# Altium schematic sheet Sheet2.SchDoc
size A3; DocumentNumber: 2; SheetNumber: 2; SheetTotal: 4
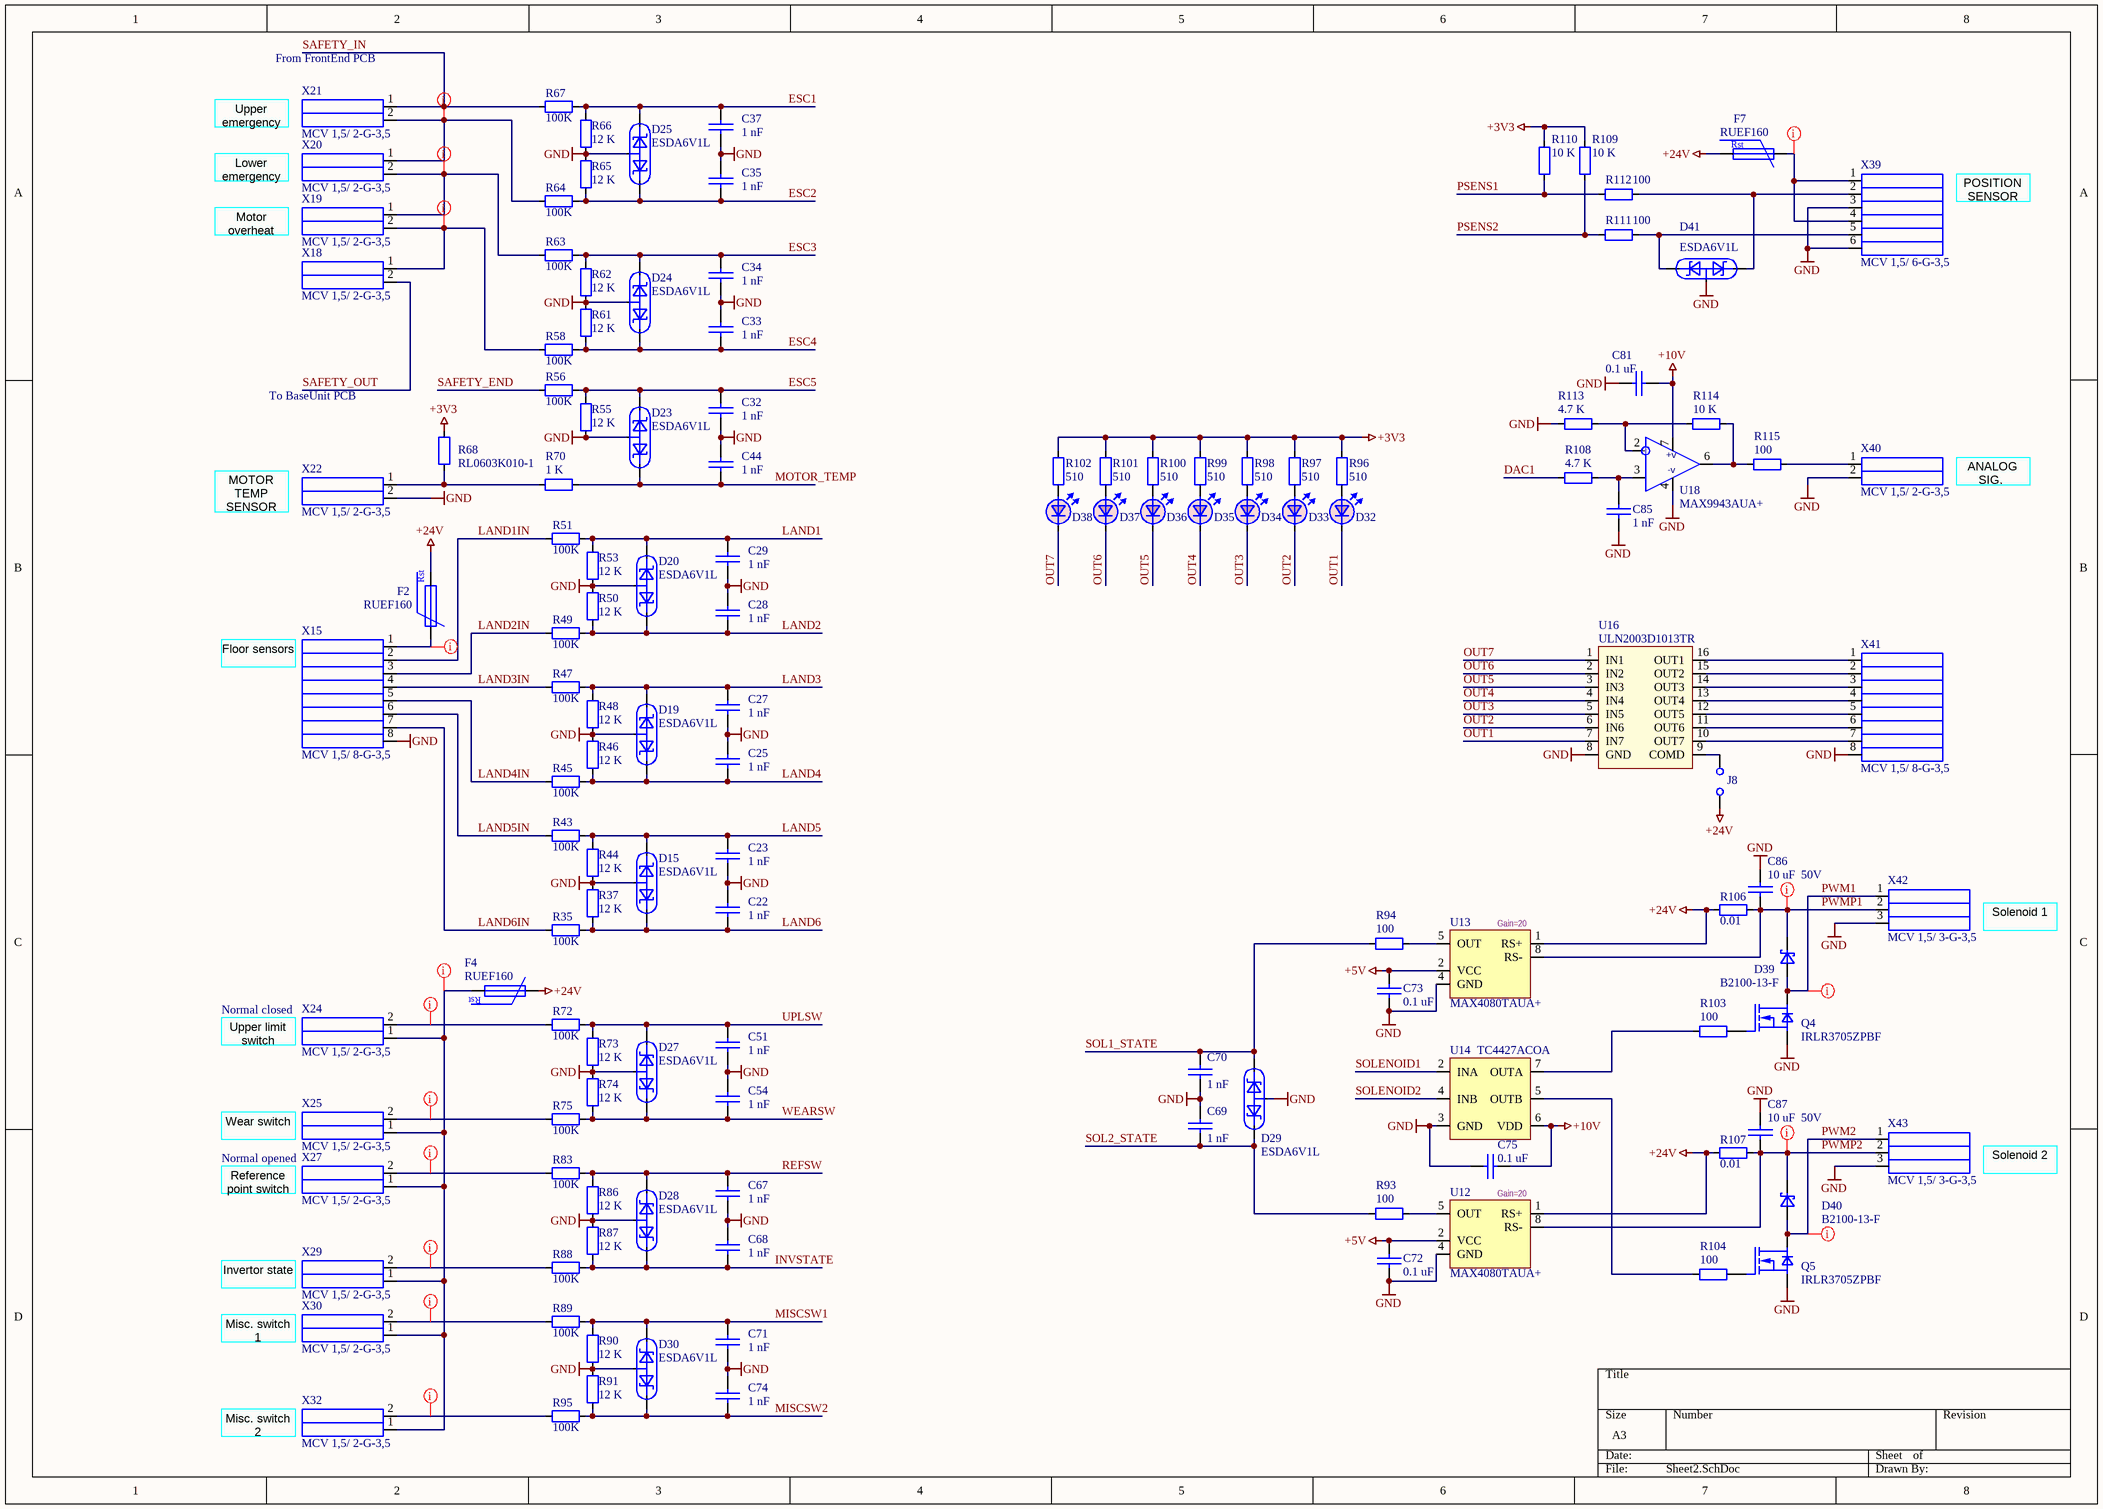
[diagram p0: Sheet2.SchDoc]

## Parts
C22  value 1 nF  [1608[0603]]  (hidden comment: CVNF1.0K0603)
C23  value 1 nF  [1608[0603]]  (hidden comment: CVNF1.0K0603)
C25  value 1 nF  [1608[0603]]  (hidden comment: CVNF1.0K0603)
C27  value 1 nF  [1608[0603]]  (hidden comment: CVNF1.0K0603)
C28  value 1 nF  [1608[0603]]  (hidden comment: CVNF1.0K0603)
C29  value 1 nF  [1608[0603]]  (hidden comment: CVNF1.0K0603)
C32  value 1 nF  [1608[0603]]  (hidden comment: CVNF1.0K0603)
C33  value 1 nF  [1608[0603]]  (hidden comment: CVNF1.0K0603)
C34  value 1 nF  [1608[0603]]  (hidden comment: CVNF1.0K0603)
C35  value 1 nF  [1608[0603]]  (hidden comment: CVNF1.0K0603)
C37  value 1 nF  [1608[0603]]  (hidden comment: CVNF1.0K0603)
C44  value 1 nF  [1608[0603]]  (hidden comment: CVNF1.0K0603)
C51  value 1 nF  [1608[0603]]  (hidden comment: CVNF1.0K0603)
C54  value 1 nF  [1608[0603]]  (hidden comment: CVNF1.0K0603)
C67  value 1 nF  [1608[0603]]  (hidden comment: CVNF1.0K0603)
C68  value 1 nF  [1608[0603]]  (hidden comment: CVNF1.0K0603)
C69  value 1 nF  [1608[0603]]  (hidden comment: CVNF1.0K0603)
C70  value 1 nF  [1608[0603]]  (hidden comment: CVNF1.0K0603)
C71  value 1 nF  [1608[0603]]  (hidden comment: CVNF1.0K0603)
C72  value 0.1 uF  [1608[0603]]  (hidden comment: CVNF100K0603-25)
C73  value 0.1 uF  [1608[0603]]  (hidden comment: CVNF100K0603-25)
C74  value 1 nF  [1608[0603]]  (hidden comment: CVNF1.0K0603)
C75  value 0.1 uF  [1608[0603]]  (hidden comment: CVNF100K0603-25)
C81  value 0.1 uF  [1608[0603]]  (hidden comment: CVNF100K0603-25)
C85  value 1 nF  [1608[0603]]  (hidden comment: CVNF1.0K0603)
C86  value 10 uF  Voltage: 50V  [3225[1210]]  (hidden comment: GRM32DF51H106ZA01L)
C87  value 10 uF  Voltage: 50V  [3225[1210]]  (hidden comment: GRM32DF51H106ZA01L)
D15  ESDA6V1L  [SOT23]
D19  ESDA6V1L  [SOT23]
D20  ESDA6V1L  [SOT23]
D23  ESDA6V1L  [SOT23]
D24  ESDA6V1L  [SOT23]
D25  ESDA6V1L  [SOT23]
D27  ESDA6V1L  [SOT23]
D28  ESDA6V1L  [SOT23]
D29  ESDA6V1L  [SOT23]
D30  ESDA6V1L  [SOT23]
D32  SML-211UTT86  [0805 LED]  (value not drawn)
D33  SML-211UTT86  [0805 LED]  (value not drawn)
D34  SML-211UTT86  [0805 LED]  (value not drawn)
D35  SML-211UTT86  [0805 LED]  (value not drawn)
D36  SML-211UTT86  [0805 LED]  (value not drawn)
D37  SML-211UTT86  [0805 LED]  (value not drawn)
D38  SML-211UTT86  [0805 LED]  (value not drawn)
D39  B2100-13-F  [SMB ST]
D40  B2100-13-F  [SMB ST]
D41  ESDA6V1L  [SOT23]
F2  RUEF160  [RUE160]
F4  RUEF160  [RUE160]
F7  RUEF160  [RUE160]
J8  PH1-02-TA-HT  [HDR1X2V]  (value not drawn)
Q4  IRLR3705ZPBF  [DPAK TO-252]
Q5  IRLR3705ZPBF  [DPAK TO-252]
R35  value 100K  [3216[1206]]  (hidden comment: ERJ-8ENF1003V)
R37  value 12 K  [0603]  (hidden comment: RL0603K012-1)
R43  value 100K  [3216[1206]]  (hidden comment: ERJ-8ENF1003V)
R44  value 12 K  [0603]  (hidden comment: RL0603K012-1)
R45  value 100K  [3216[1206]]  (hidden comment: ERJ-8ENF1003V)
R46  value 12 K  [0603]  (hidden comment: RL0603K012-1)
R47  value 100K  [3216[1206]]  (hidden comment: ERJ-8ENF1003V)
R48  value 12 K  [0603]  (hidden comment: RL0603K012-1)
R49  value 100K  [3216[1206]]  (hidden comment: ERJ-8ENF1003V)
R50  value 12 K  [0603]  (hidden comment: RL0603K012-1)
R51  value 100K  [3216[1206]]  (hidden comment: ERJ-8ENF1003V)
R53  value 12 K  [0603]  (hidden comment: RL0603K012-1)
R55  value 12 K  [0603]  (hidden comment: RL0603K012-1)
R56  value 100K  [3216[1206]]  (hidden comment: ERJ-8ENF1003V)
R58  value 100K  [3216[1206]]  (hidden comment: ERJ-8ENF1003V)
R61  value 12 K  [0603]  (hidden comment: RL0603K012-1)
R62  value 12 K  [0603]  (hidden comment: RL0603K012-1)
R63  value 100K  [3216[1206]]  (hidden comment: ERJ-8ENF1003V)
R64  value 100K  [3216[1206]]  (hidden comment: ERJ-8ENF1003V)
R65  value 12 K  [0603]  (hidden comment: RL0603K012-1)
R66  value 12 K  [0603]  (hidden comment: RL0603K012-1)
R67  value 100K  [3216[1206]]  (hidden comment: ERJ-8ENF1003V)
R68  RL0603K010-1  [0603]
R70  value 1 K  [0603]  (hidden comment: RC0603FR-071KL)
R72  value 100K  [3216[1206]]  (hidden comment: ERJ-8ENF1003V)
R73  value 12 K  [0603]  (hidden comment: RL0603K012-1)
R74  value 12 K  [0603]  (hidden comment: RL0603K012-1)
R75  value 100K  [3216[1206]]  (hidden comment: ERJ-8ENF1003V)
R83  value 100K  [3216[1206]]  (hidden comment: ERJ-8ENF1003V)
R86  value 12 K  [0603]  (hidden comment: RL0603K012-1)
R87  value 12 K  [0603]  (hidden comment: RL0603K012-1)
R88  value 100K  [3216[1206]]  (hidden comment: ERJ-8ENF1003V)
R89  value 100K  [3216[1206]]  (hidden comment: ERJ-8ENF1003V)
R90  value 12 K  [0603]  (hidden comment: RL0603K012-1)
R91  value 12 K  [0603]  (hidden comment: RL0603K012-1)
R93  value 100  [0603]  (hidden comment: ERJ-3EKF1000V)
R94  value 100  [0603]  (hidden comment: ERJ-3EKF1000V)
R95  value 100K  [3216[1206]]  (hidden comment: ERJ-8ENF1003V)
R96  value 510  [0603]  (hidden comment: RL0603E510-1)
R97  value 510  [0603]  (hidden comment: RL0603E510-1)
R98  value 510  [0603]  (hidden comment: RL0603E510-1)
R99  value 510  [0603]  (hidden comment: RL0603E510-1)
R100  value 510  [0603]  (hidden comment: RL0603E510-1)
R101  value 510  [0603]  (hidden comment: RL0603E510-1)
R102  value 510  [0603]  (hidden comment: RL0603E510-1)
R103  value 100  [0603]  (hidden comment: ERJ-3EKF1000V)
R104  value 100  [0603]  (hidden comment: ERJ-3EKF1000V)
R106  value 0.01  [MCS3264]  (hidden comment: MCS3264R010FER)
R107  value 0.01  [MCS3264]  (hidden comment: MCS3264R010FER)
R108  value 4.7 K  [0603]  (hidden comment: RL0603K004.7-1)
R109  value 10 K  [0603]  (hidden comment: RL0603K010-1)
R110  value 10 K  [0603]  (hidden comment: RL0603K010-1)
R111  value 100  [0603]  (hidden comment: ERJ-3EKF1000V)
R112  value 100  [0603]  (hidden comment: ERJ-3EKF1000V)
R113  value 4.7 K  [0603]  (hidden comment: RL0603K004.7-1)
R114  value 10 K  [0603]  (hidden comment: RL0603K010-1)
R115  value 100  [0603]  (hidden comment: ERJ-3EKF1000V)
U12  MAX4080TAUA+  [MSOP 8]
U13  MAX4080TAUA+  [MSOP 8]
U14  TC4427ACOA  [SO-8]
U16  ULN2003D1013TR  [SO-16]
U18  MAX9943AUA+  [TSSOP-8]
X15  MCV 1,5/ 8-G-3,5  [mcv1.5-8-g_3.5]
X18  MCV 1,5/ 2-G-3,5  [mcv1.5-2-g_3.5]
X19  MCV 1,5/ 2-G-3,5  [mcv1.5-2-g_3.5]
X20  MCV 1,5/ 2-G-3,5  [mcv1.5-2-g_3.5]
X21  MCV 1,5/ 2-G-3,5  [mcv1.5-2-g_3.5]
X22  MCV 1,5/ 2-G-3,5  [mcv1.5-2-g_3.5]
X24  MCV 1,5/ 2-G-3,5  [mcv1.5-2-g_3.5]
X25  MCV 1,5/ 2-G-3,5  [mcv1.5-2-g_3.5]
X27  MCV 1,5/ 2-G-3,5  [mcv1.5-2-g_3.5]
X29  MCV 1,5/ 2-G-3,5  [mcv1.5-2-g_3.5]
X30  MCV 1,5/ 2-G-3,5  [mcv1.5-2-g_3.5]
X32  MCV 1,5/ 2-G-3,5  [mcv1.5-2-g_3.5]
X39  MCV 1,5/ 6-G-3,5  [mcv1.5-6-g_3.5]
X40  MCV 1,5/ 2-G-3,5  [mcv1.5-2-g_3.5]
X41  MCV 1,5/ 8-G-3,5  [mcv1.5-8-g_3.5]
X42  MCV 1,5/ 3-G-3,5  [mcv1.5-3-g_3.5]
X43  MCV 1,5/ 3-G-3,5  [mcv1.5-3-g_3.5]

## Nets
+3V3: R68.1 R96.2 R97.2 R98.2 R99.2 R100.2 R101.2 R102.2 R109.2 R110.2
+5V: C72.2 C73.2 U12.2(VCC) U13.2(VCC)
+10V: C75.2 C81.2 U14.6(VDD) U18.7(V+)
+24V: F2.2 F4.1 F7.2 J8.1 R106.2 R107.2 U12.1(RS+) U13.1(RS+)
GND: C22.1 C23.2 C25.1 C27.2 C28.1 C29.2 C32.2 C33.1 C34.2 C35.1 C37.2 C44.1 C51.2 C54.1 C67.2 C68.1 C69.1 C70.2 C71.2 C72.1 C73.1 C74.1 C75.1 C81.1 C85.2 C86.1 C87.1 D15.3 D19.3 D20.3 D23.3 D24.3 D25.3 D27.3 D28.3 D29.3 D30.3 D41.3 Q4.3(S) Q5.3(S) R37.2 R44.1 R46.2 R48.1 R50.2 R53.1 R55.1 R61.2 R62.1 R65.2 R66.1 R73.1 R74.2 R86.1 R87.2 R90.1 R91.2 R113.2 U12.4(GND) U13.4(GND) U14.3(GND) U16.8(GND) U18.4(GND) X15.8 X22.2 X39.3 X39.6 X40.2 X41.8 X42.3(-) X43.3(-)
DAC1: R108.2
ESC1: C37.1 D25.2 R66.2 R67.2
ESC2: C35.2 D25.1 R64.2 R65.1
ESC3: C34.1 D24.2 R62.2 R63.2
ESC4: C33.2 D24.1 R58.2 R61.1
ESC5: C32.1 D23.2 R55.2 R56.2
INVSTATE: C68.2 D28.2 R87.1 R88.2
LAND1: C29.1 D20.2 R51.2 R53.2
LAND1IN: R51.1 X15.2
LAND2: C28.2 D20.1 R49.2 R50.1
LAND2IN: R49.1 X15.3
LAND3: C27.1 D19.2 R47.2 R48.2
LAND3IN: R47.1 X15.4
LAND4: C25.2 D19.1 R45.2 R46.1
LAND4IN: R45.1 X15.5
LAND5: C23.1 D15.2 R43.2 R44.2
LAND5IN: R43.1 X15.6
LAND6: C22.2 D15.1 R35.2 R37.1
LAND6IN: R35.1 X15.7
MISCSW1: C71.1 D30.1 R89.2 R90.2
MISCSW2: C74.2 D30.2 R91.1 R95.2
MOTOR_TEMP: C44.2 D23.1 R70.2
OUT1: D32.2 U16.7(IN7)
OUT2: D33.2 U16.6(IN6)
OUT3: D34.2 U16.5(IN5)
OUT4: D35.2 U16.4(IN4)
OUT5: D36.2 U16.3(IN3)
OUT6: D37.2 U16.2(IN2)
OUT7: D38.2 U16.1(IN1)
PSENS1: R110.1 R112.1
PSENS2: R109.1 R111.1
PWM1: D39.1(A) Q4.4(D) X42.1(-)
PWM2: D40.1(A) Q5.4(D) X43.1(-)
PWMP1: C86.2 D39.2(C) R106.1 U13.8(RS-) X42.2(-)
PWMP2: C87.2 D40.2(C) R107.1 U12.8(RS-) X43.2(-)
REFSW: C67.1 D28.1 R83.2 R86.2
SAFETY_END: R56.1
SAFETY_IN: R67.1 X21.1
SAFETY_OUT: X18.2
SOL1_STATE: C70.1 D29.2 R94.1
SOL2_STATE: C69.2 D29.1 R93.1
SOLENOID1: U14.2(INA)
SOLENOID2: U14.4(INB)
UPLSW: C51.1 D27.1 R72.2 R73.2
WEARSW: C54.2 D27.2 R74.1 R75.2
NetC85_1: C85.1 R108.1 U18.3(IN+)
NetD32_1: D32.1 R96.1
NetD33_1: D33.1 R97.1
NetD34_1: D34.1 R98.1
NetD35_1: D35.1 R99.1
NetD36_1: D36.1 R100.1
NetD37_1: D37.1 R101.1
NetD38_1: D38.1 R102.1
NetD41_1: D41.1 R111.2 X39.5
NetD41_2: D41.2 R112.2 X39.2
NetF2_1: F2.1 X15.1
NetF4_2: F4.2 X24.1 X25.1 X27.1 X29.1 X30.1 X32.1
NetF7_1: F7.1 X39.1 X39.4
NetJ8_2: J8.2 U16.9(COMD)
NetQ4_1: Q4.1(G) R103.2
NetQ5_1: Q5.1(G) R104.2
NetR58_1: R58.1 X18.1 X19.2
NetR63_1: R63.1 X19.1 X20.2
NetR64_1: R64.1 X20.1 X21.2
NetR68_2: R68.2 R70.1 X22.1
NetR72_1: R72.1 X24.2
NetR75_1: R75.1 X25.2
NetR83_1: R83.1 X27.2
NetR88_1: R88.1 X29.2
NetR89_1: R89.1 X30.2
NetR93_2: R93.2 U12.5(OUT)
NetR94_2: R94.2 U13.5(OUT)
NetR95_1: R95.1 X32.2
NetR103_1: R103.1 U14.7(OUTA)
NetR104_1: R104.1 U14.5(OUTB)
NetR113_1: R113.1 R114.1 U18.2(IN-)
NetR114_2: R114.2 R115.1 U18.6(OUT)
NetR115_2: R115.2 X40.1
NetU16_10: U16.10(OUT7) X41.7
NetU16_11: U16.11(OUT6) X41.6
NetU16_12: U16.12(OUT5) X41.5
NetU16_13: U16.13(OUT4) X41.4
NetU16_14: U16.14(OUT3) X41.3
NetU16_15: U16.15(OUT2) X41.2
NetU16_16: U16.16(OUT1) X41.1

## Layout directives
net class 24V: NetF2_1, NetF4_2, NetF7_1, NetR58_1, NetR63_1, NetR64_1, NetR72_1, NetR75_1, NetR83_1, NetR88_1, NetR89_1, NetR95_1, PWM1, PWM2, PWMP1, PWMP2

## Notes on the sheet
- (near X21) From FrontEnd PCB
- Upper emergency limit switch
- Lower emergency limit switch
- Motor overheat
- POSITION SENSOR
- To BaseUnit PCB
- MOTOR TEMP SENSOR
  NTC 10K B57703M0103G040
- ANALOG SIG.
  TO INVERTOR
- Floor sensors
- (near U13) Gain=20
- Solenoid 1
- Normal closed
- Upper limit switch
- Normal opened
- Wear switch
- Reference point switch
- Solenoid 2
- Gain=20
- Invertor state
- Misc. switch 1
- Misc. switch 2
- (in symbol MAX9943AUA+) +v; -v
- (in symbol RUEF160) Rst

## Library data of the parts
C22 C23 C25 C27-C29 C32-C35 C37 C44 C51 C54 C67-C71 C74 C85 = CVNF1.0K0603: 1 nF, 50V, 10%, X7R, 0603 SMD MLC Capacitor; Manufacturer: Darfon; PartNum: CL10B102KB8NNNC; Tolerance: +-10%; Distributor: Schukat; Price: 0.0047 Euro; Voltage: 50 V; PartName: CL10B102KB8NNNC
C72 C73 C75 C81 = CVNF100K0603-25: 0.1 uF, 25V, 10% , X7R,  0603 SMD MLC Capacitor; Manufacturer: SAMSUNG; PartNum: CL10B104KA8NNND; Tolerance: 10%; Distributor: Future; Price: 0.0026 Euro; Voltage: 25 V; PartName: CL10B104KA8NNND
C86 C87 = GRM32DF51H106ZA01L: 10uF, 50V, 20%, Y5V (F), 1210; Manufacturer: Taiyo Yuden; PartNum: 587-2225-2-ND; PartName: UMK325BJ106MM-T; Tolerance: 20%; Price: 0.16$; Distributor: Digi-Key
D15 D19 D20 D23-D25 D27-D30 D41 = ESDA6V1L: Dual transil array for ESD, 6.1 V, 300 W; Manufacturer: Micro Commercial Co; PartNum: ESDA6V1L-TPCT-ND; PartName: ESDA6V1L-TP; Distributor: Digi-Key; Price: 0.23$
D32-D38 = SML-211UTT86: 0805 red LED, hibright, 2 mA, 1.8V, 130°; Manufacturer: Rohm; PartNum: 511-1292-1-ND; Distributor: Digi-Key; Price: 0.34$; Value: Red; PartName: SML-211UTT86
D39 D40 = B2100-13-F: DIODE SCHOTTKY 100V 2A SMB; Manufacturer: Diodes Inc; PartNum: B2100-FDICT-ND; Price: 0.31$; Distributor: Digi-Key; PartName: B2100-13-F
F2 F4 F7 = RUEF160: RUEF160 - POLYSWITCH, RADIAL, 1.6A; Manufacturer: RAYCHEM; PartNum: RUEF160-ND; Distributor: Digi-Key; Price: 0.33$; PartName: RUEF160
J8 = Jumper: 2 Pos. 2.54 mm Single Row Through Hole Straight Pin Header; Manufacturer: ADAM TECH; Distributor: Future; Price: 0.02 Euro; PartNum: PH1-02-TA-HT; PartName: PH1-02-TA-HT
Q4 Q5 = IRLR3705ZPBF: MOSFET N-CH 55V 42A DPAK; Manufacturer: International Rectifier; PartNum: IRLR3705ZPBF-ND; Distributor: Digi-Key; Price: 1$; PartName: IRLR3705ZPBF
R35 R43 R45 R47 R49 R51 R56 R58 R63 R64 R67 R72 R75 R83 R88 R89 R95 = CRCW1206100KFKEA: 100K, 1%,  1206,  200v,  SMD 1206; Manufacturer: Panasonic; Distributor: Future; Price: 0.0036Euro; Tolerance: 1%; Voltage: 200V; PartNum: ERJ-8ENF1003V; PartName: ERJ-8ENF1003V
R37 R44 R46 R48 R50 R53 R55 R61 R62 R65 R66 R73 R74 R86 R87 R90 R91 = RL0603K012-1: 12 K, 1%, 0603, SMD Resistor, Taped; Manufacturer: Vishay; Voltage: 75 V; Distributor: Schukat; Price: 0.002 Euro; Tolerance: 1%; PartNum: RL0603K012-1; PartName: RL0603K012-1
R68 = RL0603K010-1: 10 K, 1%, 0603, SMD Resistor, Taped; Manufacturer: Vishay Dale; PartNum: 541-10KGCT-ND; PartName: CRCW060310K0JNEA; Value: 10 K; Voltage: 75 V; Distributor: Digi-Key; Price: 0.016$; Tolerance: 1%
R70 = RL0603K001-1: 1 K, 1%, 0603, SMD Resistor, Taped; Manufacturer: YAGEO AMERICA CORPORATION; Voltage: 75 V; Distributor: Future; Price: 0.0017$; Tolerance: 1%; PartNum: RC0603FR-071KL; PartName: RC0603FR-071KL
R93 R94 R103 R104 R111 R112 R115 = RL0603E100-1: 100, 1%, 0603, SMD Resistor, Taped; Manufacturer: PANASONIC; Voltage: 75 V; Tolerance: 1%; Distributor: Future; Price: 0.0017$; PartNum: ERJ-3EKF1000V; PartName: ERJ-3EKF1000V
R96-R102 = RL0603E510-1: 510 R, 1%, 0603, SMD Resistor, Taped; Manufacturer: Vishay; Voltage: 75 V; Distributor: Schukat; Price: 0.002 Euro; Tolerance: 1%; PartNum: RL0603E510-1; PartName: RL0603E510-1
R106 R107 = MCS3264R010FER: Curr.sens.res. 0.01 OHM 2W 1% , 2512 (6432 Metric); Manufacturer: Ohmite; PartNum: MCS3264R010FERCT-ND; Distributor: Digi-Key; Price: 0.3$; Tolerance: 1%; PartName: MCS3264R010FER
R108 R113 = RL0603K004.7-1: 4.7 K, 1%, 0603, SMD Resistor, Taped; Manufacturer: Vishay; Voltage: 75 V; Distributor: Schukat; Price: 0.002 Euro; Tolerance: 1%; PartNum: RL0603K004.7-1; PartName: RL0603K004.7-1
R109 R110 R114 = RL0603K010-1: 10 K, 1%, 0603, SMD Resistor, Taped; Manufacturer: Vishay Dale; PartNum: 541-10KGCT-ND; PartName: CRCW060310K0JNEA; Voltage: 75 V; Distributor: Digi-Key; Price: 0.016$; Tolerance: 1%
U12 U13 = MAX4080TAUA+: IC OPAMP CURR SENSE 250KHZ 8UMAX; Manufacturer: Infineon; PartNum: MAX4080TAUA+-ND; Price: 1.58$; Distributor: Rutnik; PartName: MAX4080TAUA+
U14 = TC4427ACOA: MOSFET drv 1.5A dual, 4.5-18 V,   8SOIC, 0-70 C; Manufacturer: Microchip Technology; PartNum: TC4427ACOA-ND; Distributor: Digi-Key; Price: 0.84$; PartName: TC4427ACOA
U16 = ULN2003D1013TR: TRANS 7 NPN DARL 50V 500MA 16SO; Manufacturer: STMicroelectronics; PartNum: 497-2345-1-ND; Distributor: DigiKey; Price: 0.52$; PartName: ULN2003D1013TR
U18 = MAX9943AUA+: OpAmp 2.4MHZ, 6..38V,  20 mA, 8-TSSOP; Manufacturer: Maxim Integrated Products; PartName: MAX9943AUA+-ND; Price: 1.46$; Distributor: Digi-Key; PartNum: MAX9943AUA+-ND
X15 X41 = MCV1.5/8-G-3.5: HEADER, VERTICAL, 3.5MM, 8WAY; Manufacturer: PHOENIX CONTACT; PartNum: 1843664; Distributor: Phoenix Contact; Price: 0.88 Euro; PartName: MCV 1,5/ 8-G-3,5
X18-X22 X24 X25 X27 X29 X30 X32 X40 = MCV1.5/2-G-3.5: HEADER, VERTICAL, 3.5MM, 2WAY; Manufacturer: PHOENIX CONTACT; PartNum: 1843606; Distributor: Phoenix Contact; Price: 0.22 Euro; PartName: MCV 1,5/ 2-G-3,5
X39 = MCV1.5/6-G-3.5: HEADER, VERTICAL, 3.5MM, 6WAY; Manufacturer: PHOENIX CONTACT; PartNum: 1843648; Distributor: Phoenix Contact; Price: 0.66 Euro; PartName: MCV 1,5/ 6-G-3,5
X42 X43 = MCV1.5/3-G-3.5: Header, 8 A, 160 V, 3.5 mm pitch, 3 pos; Manufacturer: Phoenix Contact; PartNum: 1843619; Distributor: Phoenix Contact; Price: 0.32 Euro; PartName: MCV 1,5/ 3-G-3,5